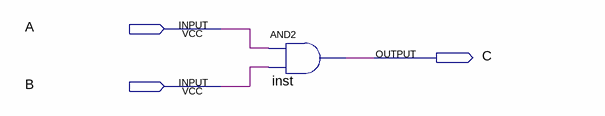
[diagram p0: schematic sheet]
// Quartus schematic porteAnd.bdf as structural Verilog: 1 symbols, 3 pins
module porteAnd (
  input  A,
  input  B,
  output C
);

  and inst (C, A, B);
endmodule
